# EAGLE design shrp-001 (EAGLE 9.6.2)
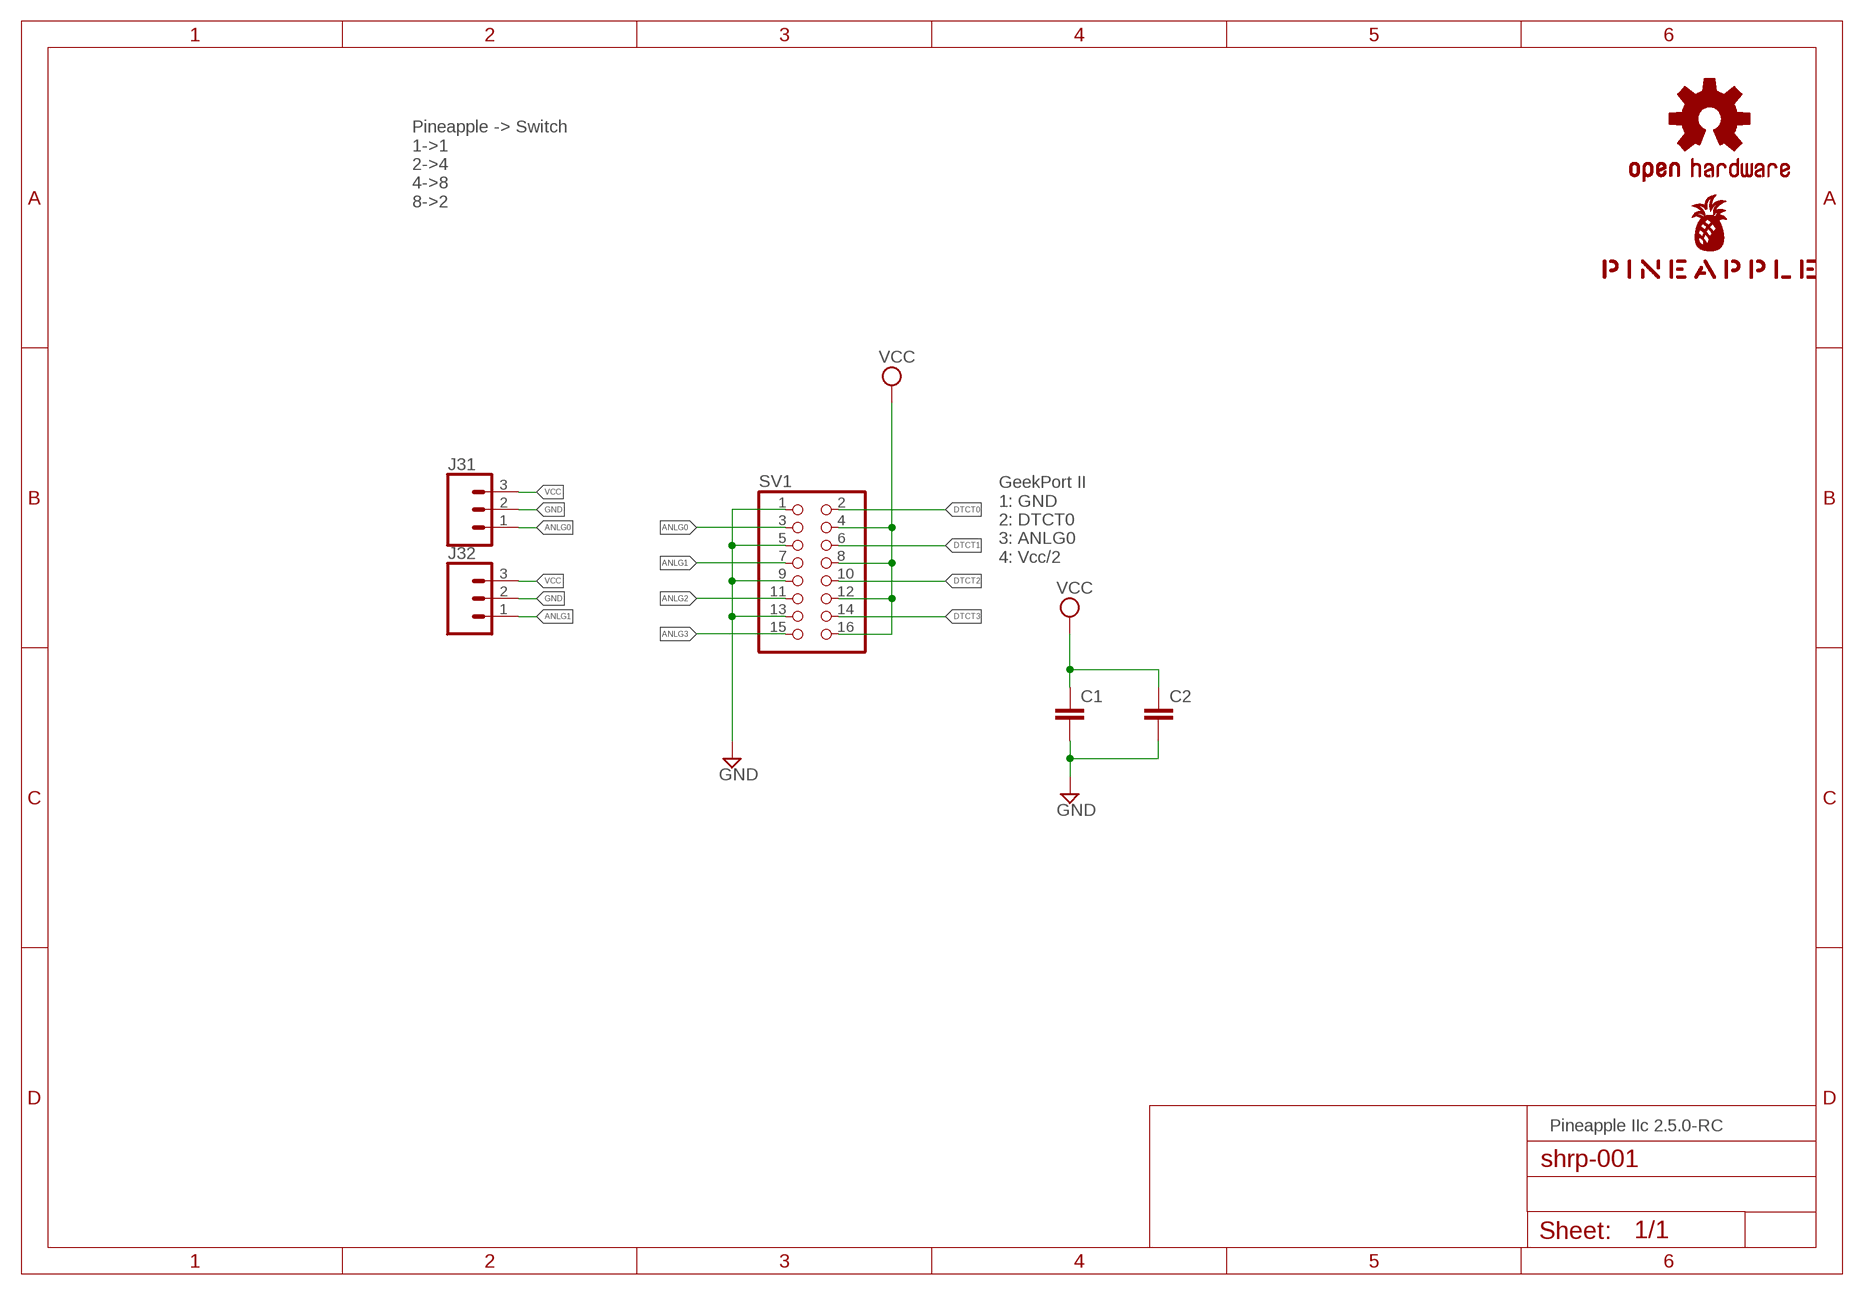
[diagram p0: schematic, sheet 1]

## Parts
C1  C-EU025-024X044  [C025-024X044]
C2  C-EU025-024X044  [C025-024X044]
J31  CONN_03JST-PTH  [JST-3-PTH]
J32  CONN_03JST-PTH  [JST-3-PTH]
LOGO1  OSHW-LOGOS-COPPER  [OSHW-LOGO-S_COPPER]
SV1  PINHD-2X8  [2X08]
U$1  PINEAPPLE450_SILK  [PINEAPPLE450_SILK]

## Nets
ANLG0: J31.1 SV1.3
ANLG1: J32.1 SV1.7
ANLG2: SV1.11
ANLG3: SV1.15
DTCT0: SV1.2
DTCT1: SV1.6
DTCT2: SV1.10
DTCT3: SV1.14
GND: C1.2 C2.2 J31.2 J32.2 SV1.1 SV1.5 SV1.9 SV1.13
VCC: C1.1 C2.1 J31.3 J32.3 SV1.4 SV1.8 SV1.12 SV1.16

## Notes on the sheet
- Pineapple -> Switch
  1->1
  2->4
  4->8
  8->2
- GeekPort II
  1: GND
  2: DTCT0
  3: ANLG0
  4: Vcc/2
- Pineapple IIc 2.5.0-RC

## Library data of the parts
C1 C2 = rcl:C-EU: CAPACITOR, European symbol; SPICEPREFIX: C
J31 J32 = SparkFun-Connectors:CONN_03: Multi connection point. Often used as Generic Header-pin footprint for 0.1 inch spaced/style header connections On any of the 0.1 inch spaced packages, you can populate with these: Break Away Headers - Straight <https://www.sparkfun.com/products/116> (PRT-00116) Break Away Male Headers - Right Angle <https://www.sparkfun.com/products/553> (PRT-00553) Female Headers <https://www.sparkfun.com/products/115> (PRT-00115) Break Away Headers - Machine Pin <https://www.sparkfun.com/products/117> (PRT-00117) Break Away Female Headers - Swiss Machine Pin <https://www.sparkfun.com/products/743> (PRT-00743) Stackable Header - 3 Pin (Female, 0.1") <https://www.sparkfun.com/products/13875> (PRT-13875) For SCREWTERMINALS and SPRING TERMINALS visit here: Screw Terimnals on SparkFun.com <https://www.sparkfun.com/search/results?term=Screw+Terminals> (5mm/3.5mm/2.54mm spacing) This device is also useful as a general connection point to wire up your design to another part of your project. Our various solder wires solder well into these plated through hole pads. Hook-Up Wire - Assortment (Stranded, 22 AWG) <https://www.sparkfun.com/products/11375> (PRT-11375) Hook-Up Wire - Assortment (Solid Core, 22 AWG) <https://www.sparkfun.com/products/11367> (PRT-11367) View the entire wire category on our website here <https://www.sparkfun.com/categories/141> Special notes: Molex polarized connector foot print use with SKU : PRT-08232 with associated crimp pins and housings.; PROD_ID: WIRE-10037; SF_ID: PRT-09915
LOGO1 = SparkFun-Aesthetics:OSHW-LOGO: Open-Source Hardware (OSHW) Logo This logo indicates the piece of hardware it is found on incorporates a OSHW license and/or adheres to the definition of open source hardware found here: http://freedomdefined.org/OSHW
SV1 = pinhead:PINHD-2X8: PIN HEADER
U$1 = pineapple:PINEAPPLE450_SILK

## Net classes
0 default: width 0.152 mm, drill 0.152 mm, clearance 0.152 mm
1 ground: width 0.305 mm, drill 0.152 mm, clearance 0.152 mm
2 power1: width 0.508 mm, drill 0.152 mm, clearance 0.152 mm
3 power2: width 0.61 mm, drill 0.152 mm, clearance 0.152 mm
4 analog: width 0.305 mm, drill 0.152 mm, clearance 0.152 mm
5 external: width 0.152 mm, drill 0.152 mm, clearance 0.152 mm

## Board
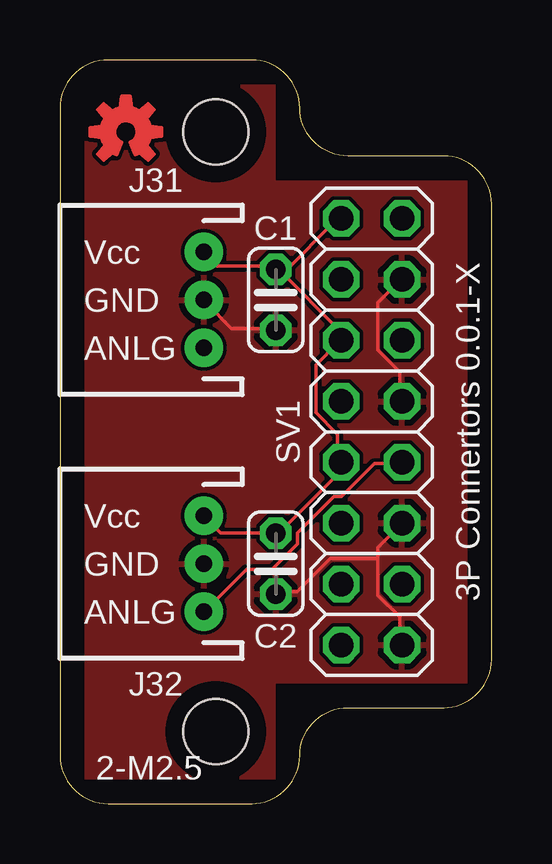
[diagram p1: board, top side]
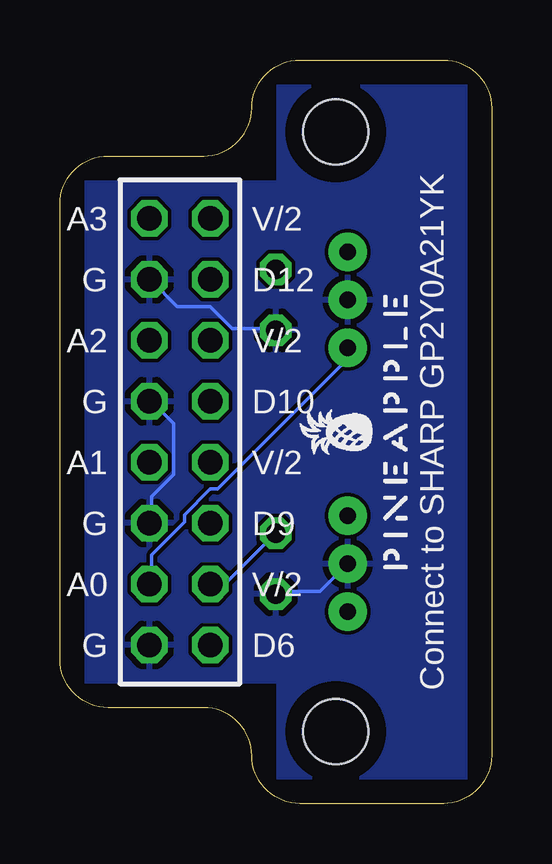
[diagram p2: board, bottom side, seen from below]

Size 18 x 31 mm. Coordinates in mm from the lower left corner, seen from the top.
Outline: 0,29 0,2 arc90 2,0 8,0 arc90 10,2 arc-90 12,4 16,4 arc90 18,6 18,25 arc90 16,27 12,27 arc-90 10,29 arc90 8,31 2,31 arc90 0,29
Copper layers (1*16): Top 0.035mm / dielectric 1.5mm / Bottom 0.035mm
Design rules "SeeedStudio_2layer_DRU_no_angle_20140221": minimum track width 6mil, minimum drill 12mil, track to track 6mil, track to pad 6mil, pad to pad 6mil, via to via 6mil, smd to smd 0mil, copper to edge 10mil, drill to drill 10mil, minimum pad ring 10mil, minimum via ring 6mil, stop-mask expansion 2mil, vias tented up to drill 100mil, thermal gap 10mil
Holes 2.7 mm at 6.5,3 6.5,28
tRestrict: area 4.5,1 to 8.5,5; area 4.5,26 to 8.5,30; area 0,0 to 1,31; area 0,30 to 10,31; area 9,26 to 10,31; area 9,26 to 18,27; area 17,4 to 18,27; area 9,4 to 18,5; area 9,0 to 10,5; area 0,0 to 10,1
bRestrict: area 0,0 to 10,1; area 17,4 to 18,27; area 0,30 to 10,31; area 0,0 to 1,31; area 4.5,1 to 8.5,5; area 4.5,26 to 8.5,30; area 9,26 to 18,27; area 9,4 to 18,5; area 9,0 to 10,5; area 9,26 to 10,31

### Footprints (pad centres in the part's own frame; a part is rotated, then mirrored left to right if it is on the bottom)
C025-024X044 = drill 0.813 octagon: 1 -1.27,0; 2 1.27,0
JST-3-PTH = drill 0.7 pad 1.6: 1 -2,0; 2 0,0; 3 2,0
2X08 = drill 1.016 octagon: 1 -8.89,-1.27; 2 -8.89,1.27; 3 -6.35,-1.27; 4 -6.35,1.27; 5 -3.81,-1.27; 6 -3.81,1.27; 7 -1.27,-1.27; 8 -1.27,1.27; 9 1.27,-1.27; 10 1.27,1.27; 11 3.81,-1.27; 12 3.81,1.27; 13 6.35,-1.27; 14 6.35,1.27; 15 8.89,-1.27; 16 8.89,1.27

### Placement (x,y rotation side)
C1  9,21 270 top
C2  9,10 270 top
J31  6,21 90 top
J32  6,10 90 top
LOGO1  2.75,28 0 top
SV1  13,15.5 90 top
U$1  3.5,15.5 90 bottom

### Tracks (layer width: path | path; a pad name or v marks a point on that pad's centre or on a via)
ANLG0
  Bottom 0.152: SV1.3 14.17,9.3 14.17,10.36 12.8,11.73 12.8,12.04 11.73,13.11 11.43,13.11 6.1,18.44 6.1,18.9 J31.1
ANLG1
  Top 0.152: SV1.7 14.17,14.17 13.11,14.17 11.73,12.8 11.43,12.8 9.91,11.28 9.91,10.82 8.84,9.75 7.77,9.75 6.1,8.08 J32.1
GND
  Top 0.152: 13.26,10.21 13.26,10.67 14.17,11.58 SV1.5 | 13.26,10.21 13.26,8.69 14.17,7.77 14.17,6.71 SV1.1 | 13.26,10.21 11.28,10.21 9.91,8.84 9.14,8.84 C2.2 | C1.2 8.99,19.81 7.16,19.81 6.1,20.88 J31.2 | SV1.9 14.17,16.92 14.17,17.98 13.26,18.9 13.26,20.88 14.17,21.79 SV1.13
  Bottom 0.152: C2.2 8.99,8.84 7.16,8.84 6.1,9.91 J32.2 | C1.2 9.14,19.81 10.82,19.81 11.73,20.73 13.11,20.73 14.17,21.79 SV1.13 | SV1.5 14.17,11.73 14.17,12.8 13.26,13.72 13.26,15.85 14.17,16.76 SV1.9
  pour Top: -1,-1 19,-1 19,32 -1,32
  pour Bottom: -2,-2 20,-2 20,33 -2,33
VCC
  Top 0.152: J32.3 6.1,11.89 6.71,11.28 C2.1 9.14,11.28 11.58,13.72 11.58,14.17 SV1.8 11.58,14.33 11.58,15.39 10.67,16.31 10.67,18.29 11.58,19.2 SV1.12 11.58,19.36 11.58,19.81 9.3,22.1 | C1.1 8.99,22.4 6.55,22.4 6.1,22.86 J31.3 | 9.3,22.1 9.14,22.25 C1.1 | 9.3,22.1 11.58,24.38 SV1.16 | 9.3,22.1 C1.1
  Bottom 0.152: SV1.4 11.58,9.3 10.97,9.3 9.14,11.12 C2.1

### Text on the board
tNames: Vcc | GND | ANLG | 3P Connertors 0.0.1-X | Vcc | GND | ANLG | 2-M2.5
bNames: V/2 | A3 | D12 | G | V/2 | A2 | D10 | G | Connect to SHARP GP2Y0A21YK | V/2 | A1 | D9 | G | V/2 | A0 | D6 | G